# Altium schematic sheet StudentForce.SchDoc: Название платы
size 840 x 594 mm; ApprovedBy: Рогов; CheckedBy: Фамилия проверяющего; DrawnBy: Фамилия разработчика; DocumentNumber: Введите номер платы + Э3; SheetNumber: пусто если лист 1, иначе 1; SheetTotal: количество листов; Title1str: (вторая строка при необходимости); DocumentType: тип схемы; Format: A1; ImagePath: Введите номер платы
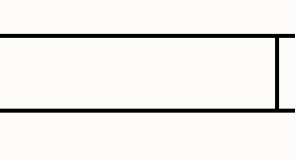
[diagram p0: StudentForce.SchDoc, top left]
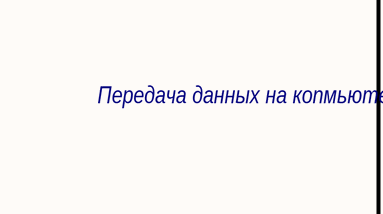
[diagram p1: StudentForce.SchDoc, top right]
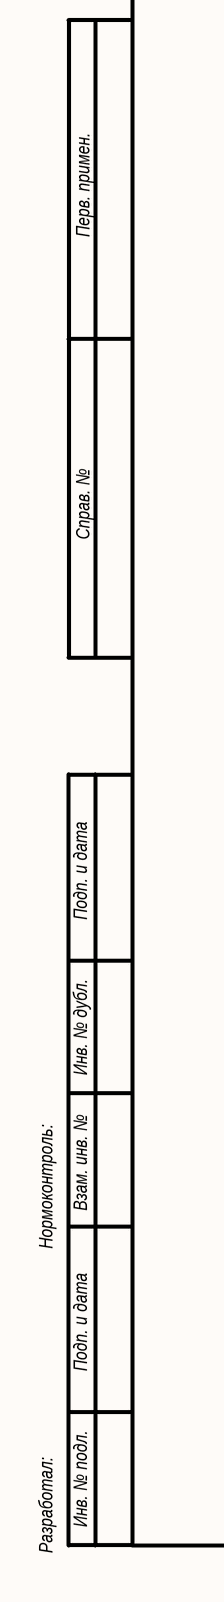
[diagram p2: StudentForce.SchDoc, bottom left]
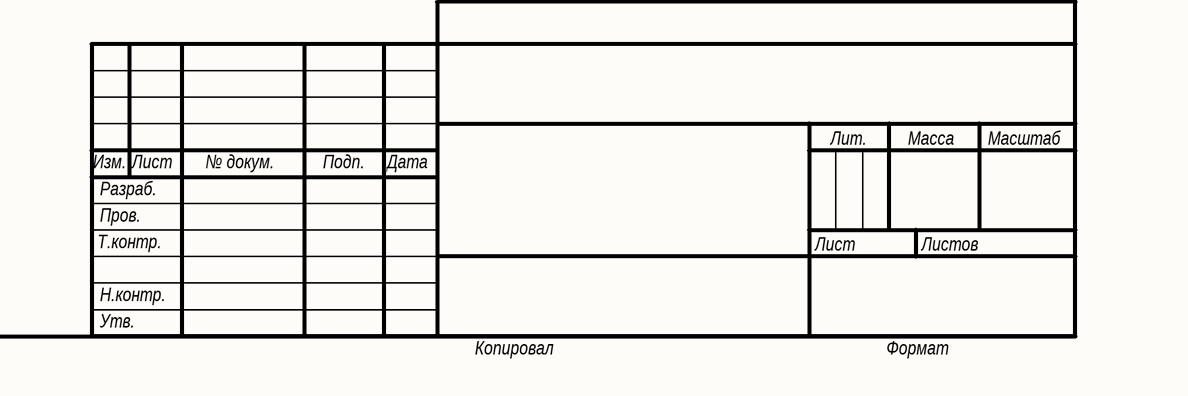
[diagram p3: StudentForce.SchDoc, bottom right]

## Notes on the sheet
- Передача данных на копмьютер
- Перв. примен.
- Справ. №
- Подп. и дата
- Инв. № дубл.
- Нормоконтроль:
- Взам. инв. №
- Изм.
- Лист
- № докум.
- Подп.
- Дата
- Лит.
- Масса
- Масштаб
- Т.контр.
- Пров.
- Разраб.
- Листов
- Разработал:
- Инв. № подл.
- Н.контр.
- Утв.
- Копировал
- Формат